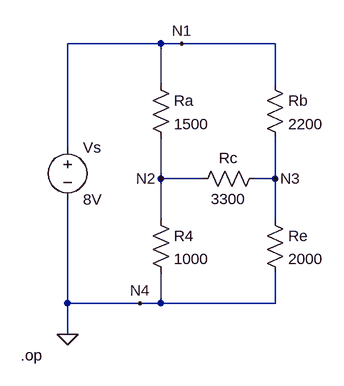
[diagram p0: schematic Circuito 3.asc]
Circuito 3.asc, the LTspice schematic file:
Version 4.1
SHEET 1 880 680
WIRE 208 -16 64 -16
WIRE 240 -16 208 -16
WIRE 384 -16 240 -16
WIRE 208 48 208 -16
WIRE 384 48 384 -16
WIRE 64 144 64 -16
WIRE 208 192 208 128
WIRE 272 192 208 192
WIRE 384 192 384 128
WIRE 384 192 352 192
WIRE 208 256 208 192
WIRE 384 256 384 192
WIRE 64 384 64 224
WIRE 176 384 64 384
WIRE 208 384 208 336
WIRE 208 384 176 384
WIRE 384 384 384 336
WIRE 384 384 208 384
WIRE 64 432 64 384
FLAG 64 432 0
FLAG 208 192 N2
FLAG 384 192 N3
FLAG 240 -16 N1
FLAG 176 384 N4
SYMBOL voltage 64 128 R0
SYMATTR InstName Vs
SYMATTR Value 8V
SYMBOL res 192 32 R0
SYMATTR InstName Ra
SYMATTR Value 1500
SYMBOL res 368 32 R0
SYMATTR InstName Rb
SYMATTR Value 2200
SYMBOL res 368 176 R90
WINDOW 0 0 56 VBottom 2
WINDOW 3 32 56 VTop 2
SYMATTR InstName Rc
SYMATTR Value 3300
SYMBOL res 192 240 R0
SYMATTR InstName R4
SYMATTR Value 1000
SYMBOL res 368 240 R0
SYMATTR InstName Re
SYMATTR Value 2000
TEXT -8 464 Left 2 !.op

The netlist it stands for:
* Circuito 3.asc
Vs N1 0 8V
Ra N1 N2 1500
Rb N1 N3 2200
Rc N3 N2 3300
R4 N2 0 1000
Re N3 0 2000
.op
.backanno
.end

* Results of the author's LTspice run, read from the files saved beside the schematic
* Operating Point:
*   V(n1) = 8 V
*   V(n2) = 3.274 V
*   V(n3) = 3.68 V
*   I(R4) = 3.274 mA
*   I(Ra) = 3.151 mA
*   I(Rb) = 1.963 mA
*   I(Rc) = 123.2 µA
*   I(Re) = 1.84 mA
*   I(Vs) = -5.114 mA